# Altium schematic sheet Conector_Motor.SchDoc
size A4
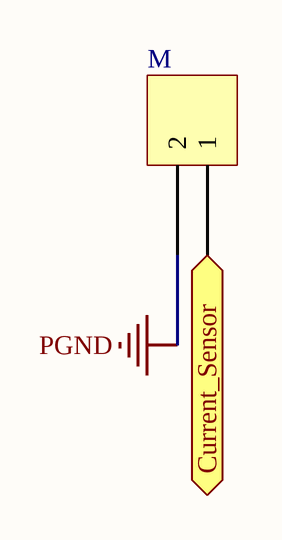
[diagram p0: Conector_Motor.SchDoc]

## Parts
M  20020110-D021A01LF  [FCI 06-381-2PIN]  (value not drawn)

## Ports
Current_Sensor (in)

## Nets
PGND: M.2
Current_Sensor: M.1 ; port Current_Sensor

## Library data of the parts
M = 20020110-D021A01LF: TERM BLOCK HDR 2POS R/A 3.81MM; Manufacturer: FCI; TemperatureRange: -40C ~ 115C; Voltage: 300V; Pitch: 0.150" (3.81mm); Number Of Positions: 2; Number Of Levels: 1; Part Number: 20020110-D021A01LF; PartId: 7785; Supplier 1: Digi-Key; Supplier Part Number 1: 609-3819-ND; ComponentLink1Description: Datasheet; ComponentLink1URL: http://portal.fciconnect.com/Comergent//fci/drawing/20020110.pdf; ComponentLink2Description: Digi-Key Listing; ComponentLink2URL: http://www.digikey.ca/product-detail/en/20020110-D021A01LF/609-3819-ND/2261255; Price: 0,75; Type: Through Hole; Colour: Green; Orientation: 90, Right Angle; Positions Per Level: 2